# Altium schematic sheet ReboostV2_CAN.SchDoc: CAN
size 420 x 297 mm; SheetNumber: 9
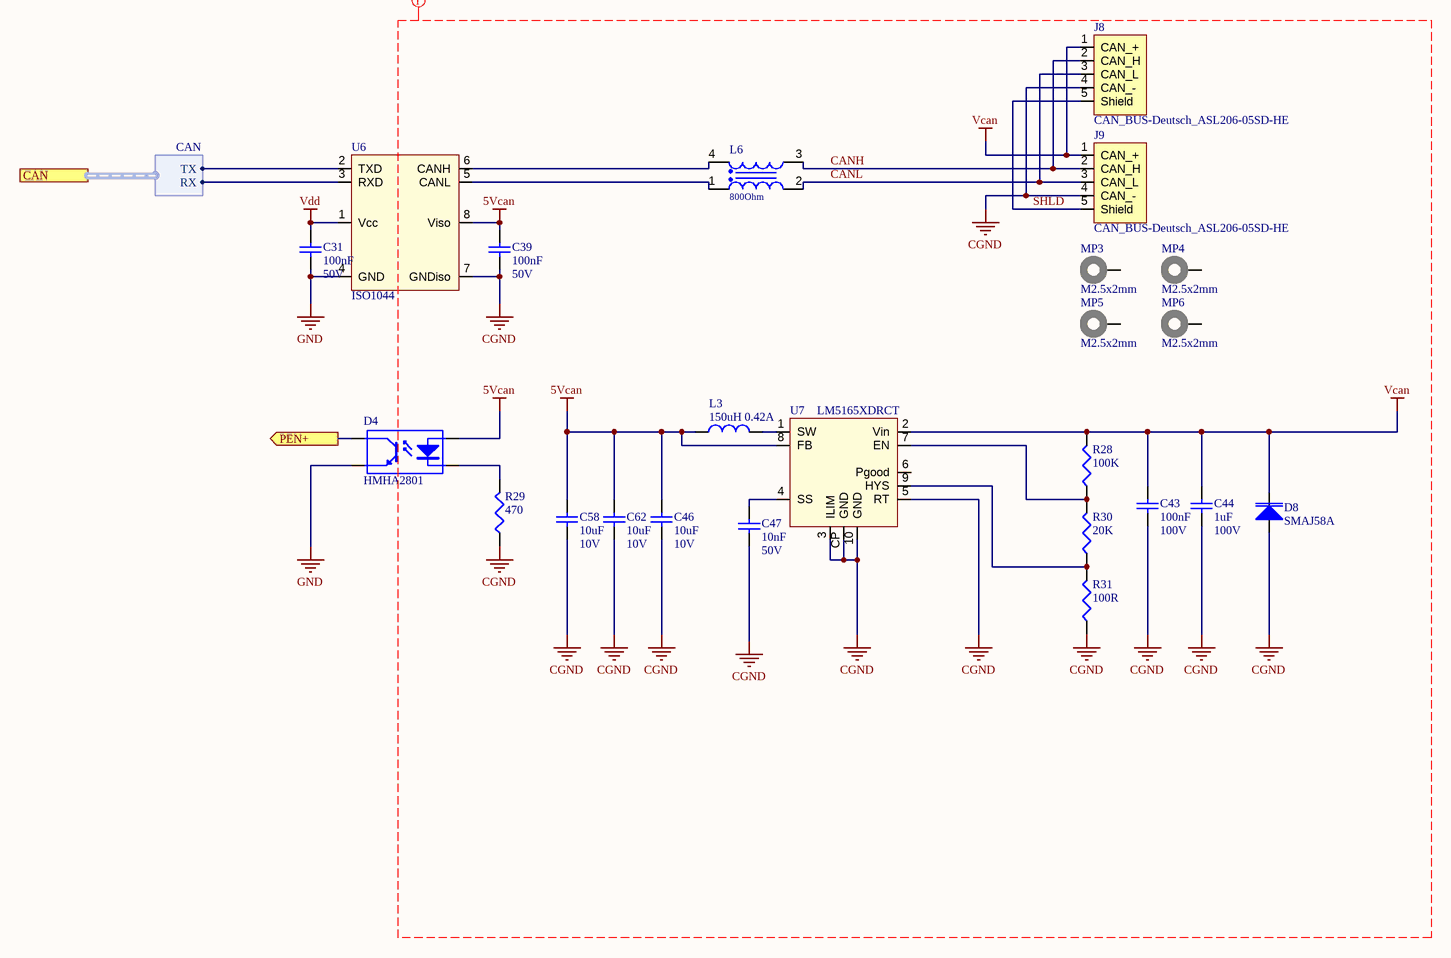
[diagram p0: ReboostV2_CAN.SchDoc]

## Parts
C31  100nF  Voltage Rating: 50V  [C0603]
C39  100nF  Voltage Rating: 50V  [C0603]
C43  100nF  Voltage Rating: 100V  [C-0805]
C44  1uF  Voltage Rating: 100V  [C-1206]
C46  10uF  Voltage Rating: 10V  [C-0805]
C47  10nF  Voltage Rating: 50V  [C0603]
C58  10uF  Voltage Rating: 10V  [C-0805]
C62  10uF  Voltage Rating: 10V  [C-0805]
D4  HMHA2801  [FSOP4]
D8  SMAJ58A  [SMA]
J8  CAN_BUS-Deutsch_ASL206-05SD-HE  [ASL206-05SD-HE]
J9  CAN_BUS-Deutsch_ASL206-05SD-HE  [ASL206-05SD-HE]
L3  150uH 0.42A  [WE-TPC 4828, MH]
L6  800Ohm  [WE-CNSW_1812]
MP3  M2.5x2mm  [9774020151]
MP4  M2.5x2mm  [9774020151]
MP5  M2.5x2mm  [9774020151]
MP6  M2.5x2mm  [9774020151]
R28  100K  [0603]
R29  470  [0603]
R30  20K  [0603]
R31  100R  [0603]
U6  ISO1044  [SO-8]
U7  LM5165XDRCT  [PWSON10]

## Ports
CAN (harness CAN), PEN+ (out)

## Harnesses
CAN: TX, RX

## Nets
5Vcan: C39.2 C46.2 C58.2 C62.2 D4.1(A1) L3.2 U6.8(Viso) U7.8(FB)
CGND: C39.1 C43.1 C44.1 C46.1 C47.1 C58.1 C62.1 D8.1 J8.4(CAN_-) J9.4(CAN_-) R29.1 R31.1 U6.7(GNDiso) U7.3(ILIM) U7.5(RT) U7.10(GND) U7.CP(GND)
GND: C31.1 D4.3(E1) U6.4(GND)
Vcan: C43.2 C44.2 D8.2 J8.1(CAN_+) J9.1(CAN_+) R28.2 U7.2(Vin)
Vdd: C31.2 U6.1(Vcc)
CANH: J8.2(CAN_H) J9.2(CAN_H) L6.3
CANL: J8.3(CAN_L) J9.3(CAN_L) L6.2
PEN+: D4.4(C1) ; port PEN+
SHLD: J8.5(Shield) J9.5(Shield)
NetC47_2: C47.2 U7.4(SS)
NetD4_2: D4.2(K1) R29.2
NetL3_1: L3.1 U7.1(SW)
NetL6_1: L6.1 U6.5(CANL)
NetL6_4: L6.4 U6.6(CANH)
NetR28_1: R28.1 R30.2 U7.7(EN)
NetR30_1: R30.1 R31.2 U7.9(HYS)
NetU6_2: U6.2(TXD) ; port CAN.TX
NetU6_3: U6.3(RXD) ; port CAN.RX

Not connected (* = marked no-connect by the designer): MP3 1; MP4 1; MP5 1; MP6 1; U7 6(Pgood)

## Layout directives
net class CANISO: 5Vcan, CANH, CANL, CGND, SHLD, Vcan

## Notes on the sheet
- PROJECT
- www.tpee.nl <http://www.tpee.nl>
- TITLE
- FILE NAME
- A3
- SIZE
- Author:
- SHEET
- OF

## Library data of the parts
C31 C39 = 100nF/0603/CER/50V: Capacitor, 100nF, 50V, X7R; Capacitance Tolerance: ± 10%; Capacitor Case Style: 0603; Brand Number: MCCA000255; Brand: MULTICOMP; Dielectric Characteristic: X7R; Capacitance: 100nF; Temperature Range: -55°C to +125°C; Price: 0,008; Order Code Supplier: 1759122RL; Supplier: Farnell
C43 = 100nF/0805/CER/100V: Capacitor, 100nF, 100V, X7R; Capacitance Tolerance: ± 10%; Capacitor Case Style: 0805; Brand Number: C0805C104K1RACTU; Brand: KEMET; Dielectric Characteristic: X7R; Capacitance: 100nF; Temperature Range: -55°C to +125°C; Price: 0,096; Order Code Supplier: 1650862; Supplier: Farnell
C44 = 1uF/1206/CER/100V: Capacitor, 1uF, 100V, X7R; Capacitance Tolerance: ± 10%; Capacitor Case Style: 1206; Brand Number: 12061C105K4Z2A; Brand: AVX; Dielectric Characteristic: X7R; Capacitance: 1uF; Temperature Range: -55°C to +125°C; Price: 0,52; Order Code Supplier: 1833855; Supplier: Farnell
C46 C58 C62 = 10uF/0805/CER/10V: Capacitor, 10uF, 10V, X7R; Capacitance Tolerance: ± 10%; Capacitor Case Style: 0805; Brand Number: GRM21BR71A106KE51L; Brand: MURATA; Dielectric Characteristic: X7R; Capacitance: 10uF; Temperature Range: -55°C to +125°C; Price: 0,36; Order Code Supplier: 1828828; Supplier: Farnell
C47 = 10nF/0603/CER/50V: Capacitor, 10nF, 50V, X7R; Capacitance Tolerance: ± 10%; Capacitor Case Style: 0603; Brand Number: C0603C103K5RACTU; Brand: KEMET; Dielectric Characteristic: X7R; Capacitance: 10nF; Temperature Range: -55°C to +125°C; Price: 0,011; Order Code Supplier: 1414609; Supplier: Farnell
D4 = HMHA2801: Optocoupler, Vout:80V, Iin:0.01A; Brand: FAIRCHILD SEMICONDUCTOR; Isolation Voltage: 2500V; Input Current: 0.01A; Output Voltage: 80V; Brand Number: HMHA2801; Case Style: *; Price: 0,28; Order Code Supplier: 1652504; Supplier: Farnell; Temperature Range: -55°C to +100°C
D8 = SMAJ58A: Diode TVS, Vrwm: 58V, Vbr: 71.2V, Vc: 93.6V, Ippm: 4.3A; Brand: MULTICOMP; Brand Number: SMAJ58A; Breakdown Voltage: 71.2V; Case Style: SMA; Clamping Voltage: 93.6V; Ippm: 4.3A; Order Code Supplier: 1579005; Price: 0,166; Supplier: Farnell; Temperature Range: -55°C to +150°C; Vrwm: 58V
J8 J9 = CMP-024-0003-1: Design Item ID: CAN_BUS-Deutsch_ASL206-05SD-HE; Source: Deutsch_lib.SchLib
L3 = 744043151: 150UH, 30%, 0.42A; Brand: Wurth; Case Style: WE-TPC 4828; DC Resistance: 0.770ohm; Brand Number: 744043151; DC Current: 0.42A; Inductance: 150uH; Order Code Supplier: 2082517; Price: 1,36; Q Factor: *; Supplier: Farnell; Temperature Range: -40°C to +125°C
L6 = 744235801: WE-CNSW SMT Common Mode Line Filter, size 1812, 800Ohm, 1A, 60V; Manufacturer: Wurth Elektronik; DC Resistance max.: 0.12Ohm; Impedance Test Condition: 100MHz; Insulation Test Voltage: 125VAC; Winding Style: bifiliar; ComponentLink1Description: Manufacturer; ComponentLink1URL: http://www.we-online.de; ComponentLink2Description: Datasheet; ComponentLink2URL: https://www.we-online.com/catalog/datasheet/744235801.pdf; Operating Temperature: -40 to +125degC; Packaging: Tape and Reel; Published Date: April 2020; Rated Current: 1A; Size: 1812; Impedance: 800Ohm; Manufacturer Part Number: 744235801; Rated Voltage: 60V; Mounting Technology: SMT
MP3-MP6 = 9774020151: WA-SMSI SMT Steel Spacer, M2.5 Thread Internal, OD 5.1mm, M2.5x2mm; Manufacturer: Wurth Elektronik; Inner Diameter: 3.5mm; Surface: Tin; ComponentLink1Description: Manufacturer; ComponentLink1URL: http://www.we-online.de; ComponentLink2Description: Datasheet; ComponentLink2URL: https://www.we-online.com/catalog/datasheet/9774020151.pdf; Mounting Technology: SMT; Packaging: Bulk; Manufacturer Part Number: 9774020151; Length: 2mm; Inner Thread Length: -; Operating Temperature: -55 to +150degC; Outer Diameter: 5.1mm; Published Date: April 2020; Material: Steel; Thread: M2.5
R28 = 100K/0603/0063W/50V: Resistor, 100K, 1%, 0.063W, 50V, 100PPM, 0603; Brand: VISHAY DRALORIC; Brand Number: CRCW0603100KFKEA; Case Style: 0603; Order Code Supplier: 2122619; Power Rating: 0.063W; Price: 0,039; Resistance: 100K; Supplier: Farnell; Temperature Coefficient: ± 100PPM; Temperature Range: -55°C to +125°C; Voltage Rating: 50V
R29 = 470/0603/0063W/50V: Resistor, 470, 1%, 0.063W, 50V, 100PPM, 0603; Brand: VISHAY DRALORIC; Brand Number: CRCW0603470RFKEA; Case Style: 0603; Order Code Supplier: 2122323; Power Rating: 0.063W; Price: 0,038; Resistance: 470; Supplier: Farnell; Temperature Coefficient: ± 100PPM; Temperature Range: -55°C to +125°C; Voltage Rating: 50V
R30 = 20K/0603/0063W/50V: Resistor, 20K, 1%, 0.063W, 50V, 100PPM, 0603; Brand: VISHAY DRALORIC; Brand Number: CRCW060320K0FKEA; Case Style: 0603; Order Code Supplier: 2122528; Power Rating: 0.063W; Price: 0,038; Resistance: 20K; Supplier: Farnell; Temperature Coefficient: ± 100PPM; Temperature Range: -55°C to +125°C; Voltage Rating: 50V
R31 = 100/0603/0063W/50V: Resistor, 100R, 1%, 0.063W, 50V, 200PPM, 0603; Brand: VISHAY DRALORIC; Brand Number: CRCW0603100RFKEA; Case Style: 0603; Order Code Supplier: 2122239; Power Rating: 0.063W; Price: 0,007; Resistance: 100R; Supplier: Farnell; Temperature Coefficient: ± 200PPM; Temperature Range: -55°C to +125°C; Voltage Rating: 50V
U6 = ISO1044: ISO1044 Isolated CAN FD Transceiver in Small Package; Supplier 1: Digi-Key; Supplier 2: Mouser; Supplier Part Number 1: 296-ISO1044DEVM-ND; Supplier Part Number 2: 595-ISO1044DEVM
U7 = LM5165X: Buck Vreg 150mA 5Vout 5-65Vin; Brand: Texas Instruments; Case Style: MSOP-8; Price: 3,70; Order Code Supplier: 595-LM5165XDRCT; Brand Number: LM5165XDRCT; Temperature Range: -40°C to +85°C; Supplier: Mouser